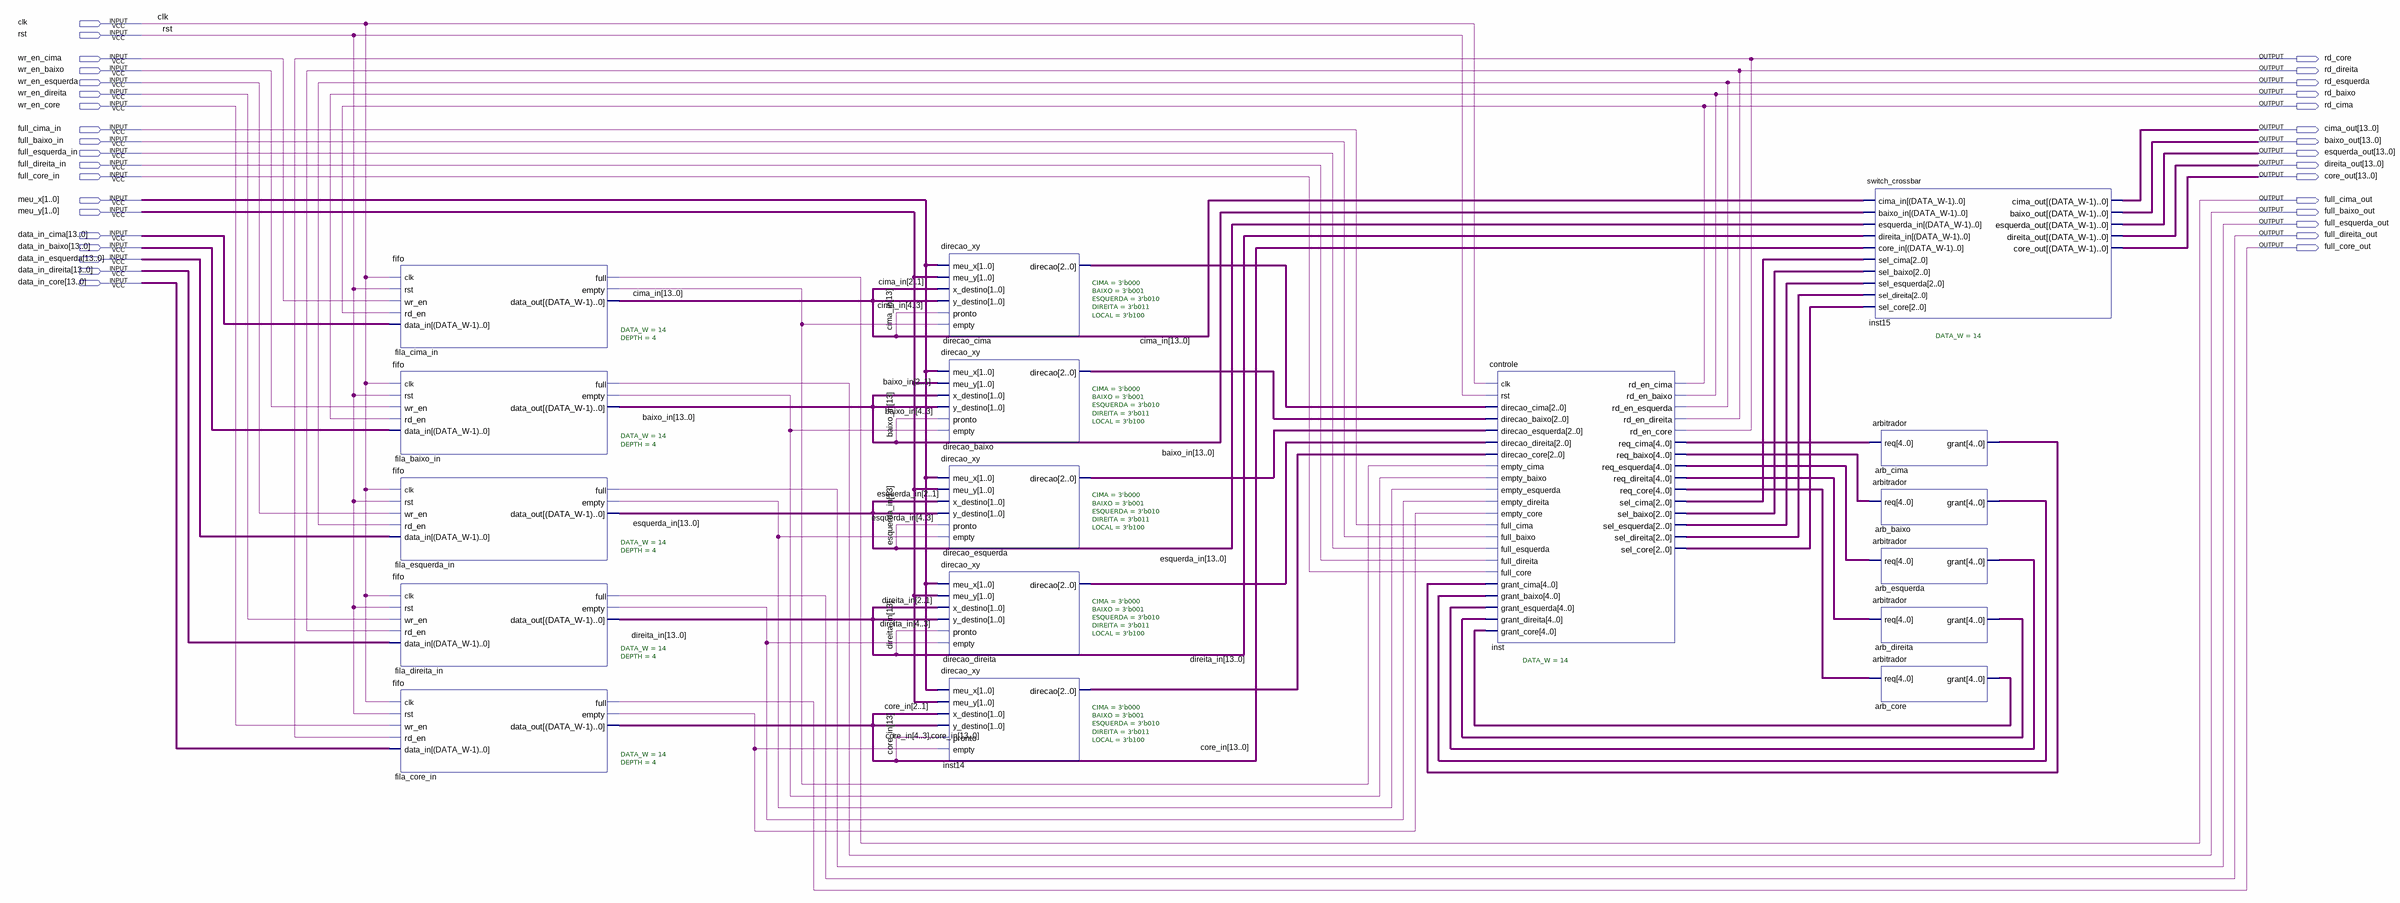
[diagram p0: schematic sheet]
// Quartus schematic roteador_top.bdf as structural Verilog: 17 symbols, 34 pins
module roteador_top (
  input  clk,
  input  rst,
  input  wr_en_cima,
  input  wr_en_baixo,
  input  wr_en_esquerda,
  input  wr_en_direita,
  input  wr_en_core,
  input  full_cima_in,
  input  full_baixo_in,
  input  full_esquerda_in,
  input  full_direita_in,
  input  full_core_in,
  input  [1:0] meu_x,
  input  [1:0] meu_y,
  input  [13:0] data_in_cima,
  input  [13:0] data_in_baixo,
  input  [13:0] data_in_esquerda,
  input  [13:0] data_in_direita,
  input  [13:0] data_in_core,
  output rd_core,
  output rd_direita,
  output rd_esquerda,
  output rd_baixo,
  output rd_cima,
  output [13:0] cima_out,
  output [13:0] baixo_out,
  output [13:0] esquerda_out,
  output [13:0] direita_out,
  output [13:0] core_out,
  output full_cima_out,
  output full_baixo_out,
  output full_esquerda_out,
  output full_direita_out,
  output full_core_out
);

  wire fila_baixo_in_empty, fila_cima_in_empty, fila_core_in_empty, fila_direita_in_empty,
       fila_esquerda_in_empty;
  wire [2:0] direcao_baixo_direcao, direcao_cima_direcao, direcao_direita_direcao, direcao_esquerda_direcao,
       inst14_direcao, inst_sel_baixo, inst_sel_cima, inst_sel_core, inst_sel_direita, inst_sel_esquerda;
  wire [4:0] arb_baixo_grant, arb_cima_grant, arb_core_grant, arb_direita_grant, arb_esquerda_grant,
       inst_req_baixo, inst_req_cima, inst_req_core, inst_req_direita, inst_req_esquerda;
  wire [13:0] baixo_in, cima_in, core_in, direita_in, esquerda_in;

  fifo #(.DATA_W(14), .DEPTH(4)) fila_cima_in (
    .clk(clk), .rst(rst), .wr_en(wr_en_cima), .rd_en(rd_cima), .data_in(data_in_cima), .full(full_cima_out),
    .empty(fila_cima_in_empty), .data_out(cima_in));
  fifo #(.DATA_W(14), .DEPTH(4)) fila_baixo_in (
    .clk(clk), .rst(rst), .wr_en(wr_en_baixo), .rd_en(rd_baixo), .data_in(data_in_baixo),
    .full(full_baixo_out), .empty(fila_baixo_in_empty), .data_out(baixo_in));
  fifo #(.DATA_W(14), .DEPTH(4)) fila_esquerda_in (
    .clk(clk), .rst(rst), .wr_en(wr_en_esquerda), .rd_en(rd_esquerda), .data_in(data_in_esquerda),
    .full(full_esquerda_out), .empty(fila_esquerda_in_empty), .data_out(esquerda_in));
  fifo #(.DATA_W(14), .DEPTH(4)) fila_direita_in (
    .clk(clk), .rst(rst), .wr_en(wr_en_direita), .rd_en(rd_direita), .data_in(data_in_direita),
    .full(full_direita_out), .empty(fila_direita_in_empty), .data_out(direita_in));
  fifo #(.DATA_W(14), .DEPTH(4)) fila_core_in (
    .clk(clk), .rst(rst), .wr_en(wr_en_core), .rd_en(rd_core), .data_in(data_in_core), .full(full_core_out),
    .empty(fila_core_in_empty), .data_out({core_in[4:3], core_in}));
  direcao_xy #(.CIMA(3'b000), .BAIXO(3'b001), .ESQUERDA(3'b010), .DIREITA(3'b011), .LOCAL(3'b100)) direcao_cima (
    .meu_x(meu_x), .meu_y(meu_y), .x_destino(cima_in[2:1]), .y_destino(cima_in[4:3]), .pronto(cima_in[13]),
    .empty(fila_cima_in_empty), .direcao(direcao_cima_direcao));
  direcao_xy #(.CIMA(3'b000), .BAIXO(3'b001), .ESQUERDA(3'b010), .DIREITA(3'b011), .LOCAL(3'b100)) direcao_baixo (
    .meu_x(meu_x), .meu_y(meu_y), .x_destino(baixo_in[2:1]), .y_destino(baixo_in[4:3]),
    .pronto(baixo_in[13]), .empty(fila_baixo_in_empty), .direcao(direcao_baixo_direcao));
  direcao_xy #(.CIMA(3'b000), .BAIXO(3'b001), .ESQUERDA(3'b010), .DIREITA(3'b011), .LOCAL(3'b100)) direcao_esquerda (
    .meu_x(meu_x), .meu_y(meu_y), .x_destino(esquerda_in[2:1]), .y_destino(esquerda_in[4:3]),
    .pronto(esquerda_in[13]), .empty(fila_esquerda_in_empty), .direcao(direcao_esquerda_direcao));
  direcao_xy #(.CIMA(3'b000), .BAIXO(3'b001), .ESQUERDA(3'b010), .DIREITA(3'b011), .LOCAL(3'b100)) direcao_direita (
    .meu_x(meu_x), .meu_y(meu_y), .x_destino(direita_in[2:1]), .y_destino(direita_in[4:3]),
    .pronto(direita_in[13]), .empty(fila_direita_in_empty), .direcao(direcao_direita_direcao));
  direcao_xy #(.CIMA(3'b000), .BAIXO(3'b001), .ESQUERDA(3'b010), .DIREITA(3'b011), .LOCAL(3'b100)) inst14 (
    .meu_x(meu_x), .meu_y(meu_y), .x_destino(core_in[2:1]), .y_destino({core_in[4:3], core_in}),
    .pronto(core_in[13]), .empty(fila_core_in_empty), .direcao(inst14_direcao));
  controle #(.DATA_W(14)) inst (
    .clk(clk), .rst(rst), .direcao_cima(direcao_cima_direcao), .direcao_baixo(direcao_baixo_direcao),
    .direcao_esquerda(direcao_esquerda_direcao), .direcao_direita(direcao_direita_direcao),
    .direcao_core(inst14_direcao), .empty_cima(fila_cima_in_empty), .empty_baixo(fila_baixo_in_empty),
    .empty_esquerda(fila_esquerda_in_empty), .empty_direita(fila_direita_in_empty),
    .empty_core(fila_core_in_empty), .full_cima(full_cima_in), .full_baixo(full_baixo_in),
    .full_esquerda(full_esquerda_in), .full_direita(full_direita_in), .full_core(full_core_in),
    .grant_cima(arb_cima_grant), .grant_baixo(arb_baixo_grant), .grant_esquerda(arb_esquerda_grant),
    .grant_direita(arb_direita_grant), .grant_core(arb_core_grant), .rd_en_cima(rd_cima),
    .rd_en_baixo(rd_baixo), .rd_en_esquerda(rd_esquerda), .rd_en_direita(rd_direita), .rd_en_core(rd_core),
    .req_cima(inst_req_cima), .req_baixo(inst_req_baixo), .req_esquerda(inst_req_esquerda),
    .req_direita(inst_req_direita), .req_core(inst_req_core), .sel_cima(inst_sel_cima),
    .sel_baixo(inst_sel_baixo), .sel_esquerda(inst_sel_esquerda), .sel_direita(inst_sel_direita),
    .sel_core(inst_sel_core));
  switch_crossbar #(.DATA_W(14)) inst15 (
    .cima_in(cima_in), .baixo_in(baixo_in), .esquerda_in(esquerda_in), .direita_in(direita_in),
    .core_in(core_in), .sel_cima(inst_sel_cima), .sel_baixo(inst_sel_baixo),
    .sel_esquerda(inst_sel_esquerda), .sel_direita(inst_sel_direita), .sel_core(inst_sel_core),
    .cima_out(cima_out), .baixo_out(baixo_out), .esquerda_out(esquerda_out), .direita_out(direita_out),
    .core_out(core_out));
  arbitrador arb_cima (.req(inst_req_cima), .grant(arb_cima_grant));
  arbitrador arb_baixo (.req(inst_req_baixo), .grant(arb_baixo_grant));
  arbitrador arb_esquerda (.req(inst_req_esquerda), .grant(arb_esquerda_grant));
  arbitrador arb_direita (.req(inst_req_direita), .grant(arb_direita_grant));
  arbitrador arb_core (.req(inst_req_core), .grant(arb_core_grant));
endmodule
